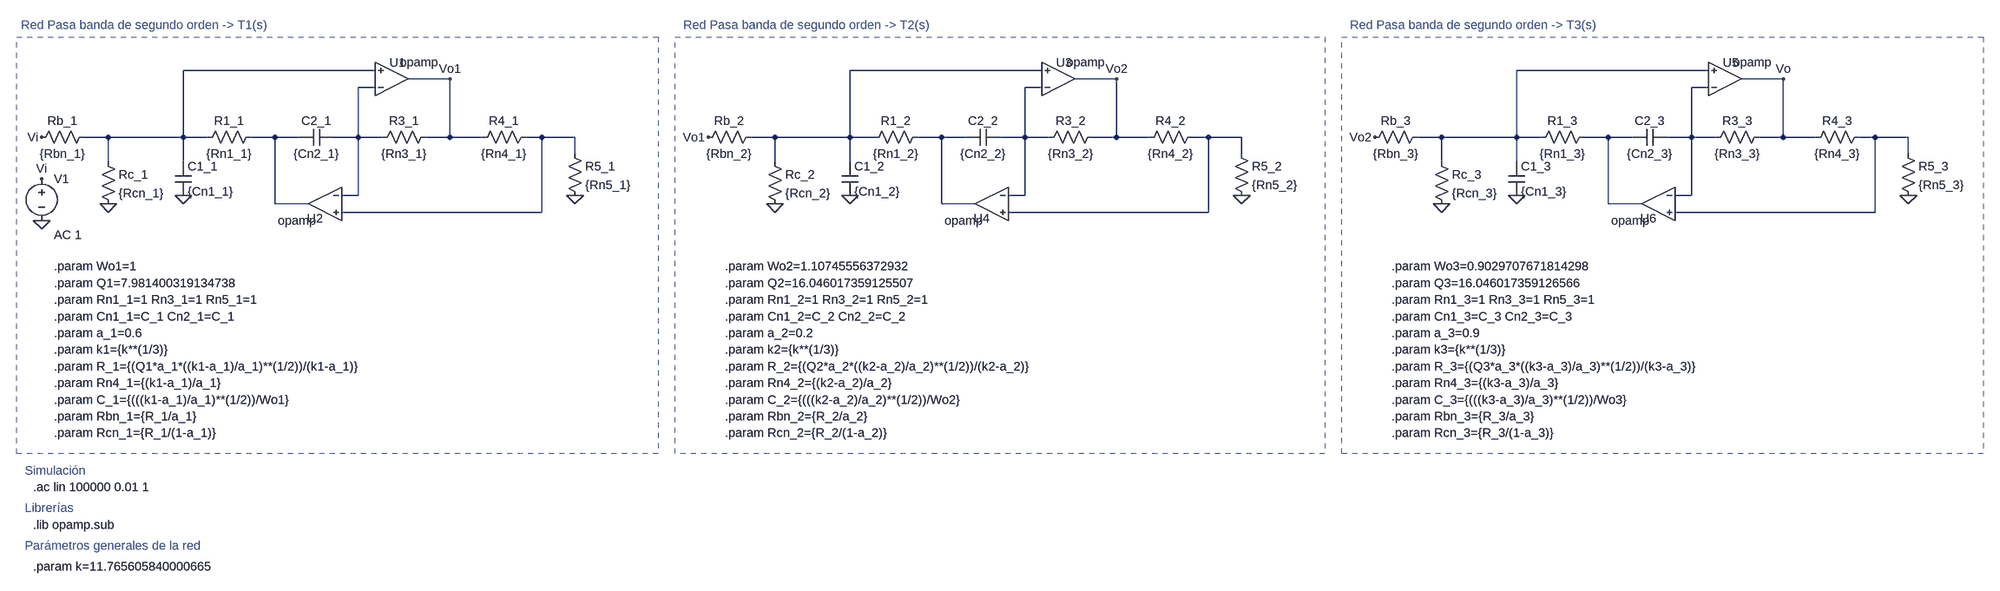
[diagram p0: schematic simulación circuital red activa 2.asc]
simulación circuital red activa 2.asc, the LTspice schematic file:
Version 4
SHEET 1 3268 1080
WIRE 176 16 -192 16
WIRE 1456 16 1088 16
WIRE 2736 16 2368 16
WIRE 320 32 240 32
WIRE 1600 32 1520 32
WIRE 2880 32 2800 32
WIRE 176 48 144 48
WIRE 1456 48 1424 48
WIRE 2736 48 2704 48
WIRE -336 144 -384 144
WIRE -192 144 -192 16
WIRE -192 144 -336 144
WIRE -144 144 -192 144
WIRE -16 144 -64 144
WIRE 32 144 -16 144
WIRE 144 144 144 48
WIRE 144 144 96 144
WIRE 192 144 144 144
WIRE 320 144 320 32
WIRE 320 144 272 144
WIRE 384 144 320 144
WIRE 496 144 464 144
WIRE 560 144 496 144
WIRE 944 144 896 144
WIRE 1088 144 1088 16
WIRE 1088 144 944 144
WIRE 1136 144 1088 144
WIRE 1264 144 1216 144
WIRE 1312 144 1264 144
WIRE 1424 144 1424 48
WIRE 1424 144 1376 144
WIRE 1472 144 1424 144
WIRE 1600 144 1600 32
WIRE 1600 144 1552 144
WIRE 1664 144 1600 144
WIRE 1776 144 1744 144
WIRE 1840 144 1776 144
WIRE 2224 144 2176 144
WIRE 2368 144 2368 16
WIRE 2368 144 2224 144
WIRE 2416 144 2368 144
WIRE 2544 144 2496 144
WIRE 2592 144 2544 144
WIRE 2704 144 2704 48
WIRE 2704 144 2656 144
WIRE 2752 144 2704 144
WIRE 2880 144 2880 32
WIRE 2880 144 2832 144
WIRE 2944 144 2880 144
WIRE 3056 144 3024 144
WIRE 3120 144 3056 144
WIRE 560 176 560 144
WIRE 1840 176 1840 144
WIRE 3120 176 3120 144
WIRE -336 192 -336 144
WIRE -192 192 -192 144
WIRE 944 192 944 144
WIRE 1088 192 1088 144
WIRE 2224 192 2224 144
WIRE 2368 192 2368 144
WIRE 144 256 144 144
WIRE 144 256 112 256
WIRE 1424 256 1424 144
WIRE 1424 256 1392 256
WIRE 2704 256 2704 144
WIRE 2704 256 2672 256
WIRE -16 272 -16 144
WIRE 48 272 -16 272
WIRE 1264 272 1264 144
WIRE 1328 272 1264 272
WIRE 2544 272 2544 144
WIRE 2608 272 2544 272
WIRE 496 288 496 144
WIRE 496 288 112 288
WIRE 1776 288 1776 144
WIRE 1776 288 1392 288
WIRE 3056 288 3056 144
WIRE 3056 288 2672 288
FLAG 560 256 0
FLAG -192 256 0
FLAG -336 272 0
FLAG -464 144 Vi
FLAG 320 32 Vo1
FLAG -464 304 0
FLAG -464 224 Vi
FLAG 1840 256 0
FLAG 1088 256 0
FLAG 944 272 0
FLAG 1600 32 Vo2
FLAG 3120 256 0
FLAG 2368 256 0
FLAG 2224 272 0
FLAG 2880 32 Vo
FLAG 816 144 Vo1
FLAG 2096 144 Vo2
SYMBOL OpAmps\\opamp 208 96 M180
WINDOW 0 -4 95 Left 2
SYMATTR InstName U1
SYMBOL OpAmps\\opamp 80 208 M0
WINDOW 0 4 92 Left 2
SYMATTR InstName U2
SYMBOL res -48 128 R90
WINDOW 0 0 56 VBottom 2
WINDOW 3 32 56 VTop 2
SYMATTR InstName R1_1
SYMATTR Value {Rn1_1}
SYMBOL cap -208 192 R0
SYMATTR InstName C1_1
SYMATTR Value {Cn1_1}
SYMBOL cap 96 128 R90
WINDOW 0 0 32 VBottom 2
WINDOW 3 32 32 VTop 2
SYMATTR InstName C2_1
SYMATTR Value {Cn2_1}
SYMBOL res 288 128 R90
WINDOW 0 0 56 VBottom 2
WINDOW 3 32 56 VTop 2
SYMATTR InstName R3_1
SYMATTR Value {Rn3_1}
SYMBOL res 480 128 R90
WINDOW 0 0 56 VBottom 2
WINDOW 3 32 56 VTop 2
SYMATTR InstName R4_1
SYMATTR Value {Rn4_1}
SYMBOL res 544 160 R0
SYMATTR InstName R5_1
SYMATTR Value {Rn5_1}
SYMBOL res -352 176 R0
SYMATTR InstName Rc_1
SYMATTR Value {Rcn_1}
SYMBOL res -368 128 R90
WINDOW 0 0 56 VBottom 2
WINDOW 3 32 56 VTop 2
SYMATTR InstName Rb_1
SYMATTR Value {Rbn_1}
SYMBOL voltage -464 208 R0
WINDOW 123 24 124 Left 2
WINDOW 39 0 0 Left 0
SYMATTR Value2 AC 1
SYMATTR InstName V1
SYMATTR Value ""
SYMBOL OpAmps\\opamp 1488 96 M180
WINDOW 0 -4 95 Left 2
SYMATTR InstName U3
SYMBOL OpAmps\\opamp 1360 208 M0
WINDOW 0 4 92 Left 2
SYMATTR InstName U4
SYMBOL res 1232 128 R90
WINDOW 0 0 56 VBottom 2
WINDOW 3 32 56 VTop 2
SYMATTR InstName R1_2
SYMATTR Value {Rn1_2}
SYMBOL cap 1072 192 R0
SYMATTR InstName C1_2
SYMATTR Value {Cn1_2}
SYMBOL cap 1376 128 R90
WINDOW 0 0 32 VBottom 2
WINDOW 3 32 32 VTop 2
SYMATTR InstName C2_2
SYMATTR Value {Cn2_2}
SYMBOL res 1568 128 R90
WINDOW 0 0 56 VBottom 2
WINDOW 3 32 56 VTop 2
SYMATTR InstName R3_2
SYMATTR Value {Rn3_2}
SYMBOL res 1760 128 R90
WINDOW 0 0 56 VBottom 2
WINDOW 3 32 56 VTop 2
SYMATTR InstName R4_2
SYMATTR Value {Rn4_2}
SYMBOL res 1824 160 R0
SYMATTR InstName R5_2
SYMATTR Value {Rn5_2}
SYMBOL res 928 176 R0
SYMATTR InstName Rc_2
SYMATTR Value {Rcn_2}
SYMBOL res 912 128 R90
WINDOW 0 0 56 VBottom 2
WINDOW 3 32 56 VTop 2
SYMATTR InstName Rb_2
SYMATTR Value {Rbn_2}
SYMBOL OpAmps\\opamp 2768 96 M180
WINDOW 0 -4 95 Left 2
SYMATTR InstName U5
SYMBOL OpAmps\\opamp 2640 208 M0
WINDOW 0 4 92 Left 2
SYMATTR InstName U6
SYMBOL res 2512 128 R90
WINDOW 0 0 56 VBottom 2
WINDOW 3 32 56 VTop 2
SYMATTR InstName R1_3
SYMATTR Value {Rn1_3}
SYMBOL cap 2352 192 R0
SYMATTR InstName C1_3
SYMATTR Value {Cn1_3}
SYMBOL cap 2656 128 R90
WINDOW 0 0 32 VBottom 2
WINDOW 3 32 32 VTop 2
SYMATTR InstName C2_3
SYMATTR Value {Cn2_3}
SYMBOL res 2848 128 R90
WINDOW 0 0 56 VBottom 2
WINDOW 3 32 56 VTop 2
SYMATTR InstName R3_3
SYMATTR Value {Rn3_3}
SYMBOL res 3040 128 R90
WINDOW 0 0 56 VBottom 2
WINDOW 3 32 56 VTop 2
SYMATTR InstName R4_3
SYMATTR Value {Rn4_3}
SYMBOL res 3104 160 R0
SYMATTR InstName R5_3
SYMATTR Value {Rn5_3}
SYMBOL res 2208 176 R0
SYMATTR InstName Rc_3
SYMATTR Value {Rcn_3}
SYMBOL res 2192 128 R90
WINDOW 0 0 56 VBottom 2
WINDOW 3 32 56 VTop 2
SYMATTR InstName Rb_3
SYMATTR Value {Rbn_3}
TEXT -480 888 Left 2 !.lib opamp.sub
TEXT -480 816 Left 2 !.ac lin 100000 0.01 1
TEXT -440 392 Left 2 !.param Wo1=1
TEXT -440 424 Left 2 !.param Q1=7.981400319134738
TEXT -440 456 Left 2 !.param Rn1_1=1 Rn3_1=1 Rn5_1=1
TEXT -440 488 Left 2 !.param Cn1_1=C_1 Cn2_1=C_1
TEXT -440 616 Left 2 !.param Rn4_1={(k1-a_1)/a_1}
TEXT -440 648 Left 2 !.param C_1={(((k1-a_1)/a_1)**(1/2))/Wo1}
TEXT -440 520 Left 2 !.param a_1=0.6
TEXT -440 680 Left 2 !.param Rbn_1={R_1/a_1}
TEXT -440 712 Left 2 !.param Rcn_1={R_1/(1-a_1)}
TEXT -440 552 Left 2 !.param k1={k**(1/3)}
TEXT -480 968 Left 2 !.param k=11.765605840000665
TEXT 848 456 Left 2 !.param Rn1_2=1 Rn3_2=1 Rn5_2=1
TEXT 848 488 Left 2 !.param Cn1_2=C_2 Cn2_2=C_2
TEXT 848 680 Left 2 !.param Rbn_2={R_2/a_2}
TEXT 848 712 Left 2 !.param Rcn_2={R_2/(1-a_2)}
TEXT 848 552 Left 2 !.param k2={k**(1/3)}
TEXT 2128 456 Left 2 !.param Rn1_3=1 Rn3_3=1 Rn5_3=1
TEXT 2128 488 Left 2 !.param Cn1_3=C_3 Cn2_3=C_3
TEXT 2128 680 Left 2 !.param Rbn_3={R_3/a_3}
TEXT 2128 712 Left 2 !.param Rcn_3={R_3/(1-a_3)}
TEXT 2128 552 Left 2 !.param k3={k**(1/3)}
TEXT -440 584 Left 2 !.param R_1={(Q1*a_1*((k1-a_1)/a_1)**(1/2))/(k1-a_1)}
TEXT 848 520 Left 2 !.param a_2=0.2
TEXT 848 584 Left 2 !.param R_2={(Q2*a_2*((k2-a_2)/a_2)**(1/2))/(k2-a_2)}
TEXT 848 616 Left 2 !.param Rn4_2={(k2-a_2)/a_2}
TEXT 848 648 Left 2 !.param C_2={(((k2-a_2)/a_2)**(1/2))/Wo2}
TEXT 2128 520 Left 2 !.param a_3=0.9
TEXT 2128 584 Left 2 !.param R_3={(Q3*a_3*((k3-a_3)/a_3)**(1/2))/(k3-a_3)}
TEXT 2128 616 Left 2 !.param Rn4_3={(k3-a_3)/a_3}
TEXT 2128 648 Left 2 !.param C_3={(((k3-a_3)/a_3)**(1/2))/Wo3}
TEXT -504 -72 Left 2 ;Red Pasa banda de segundo orden -> T1(s)
TEXT 768 -72 Left 2 ;Red Pasa banda de segundo orden -> T2(s)
TEXT 2048 -72 Left 2 ;Red Pasa banda de segundo orden -> T3(s)
TEXT -496 784 Left 2 ;Simulación
TEXT -496 856 Left 2 ;Librerías
TEXT -496 928 Left 2 ;Parámetros generales de la red
TEXT 848 392 Left 2 !.param Wo2=1.10745556372932
TEXT 848 424 Left 2 !.param Q2=16.046017359125507
TEXT 2128 392 Left 2 !.param Wo3=0.9029707671814298
TEXT 2128 424 Left 2 !.param Q3=16.046017359126566
RECTANGLE Normal 720 752 -512 -48 2
RECTANGLE Normal 2000 752 752 -48 2
RECTANGLE Normal 3264 752 2032 -48 2

The netlist it stands for:
* simulación circuital red activa 2.asc
XU1 N004 N001 Vo1 opamp Aol=100K GBW=10Meg  ; pins invin noninvin out
XU2 N004 N008 N007 opamp Aol=100K GBW=10Meg  ; pins invin noninvin out
R1_1 N007 N001 {Rn1_1}
C1_1 N001 0 {Cn1_1}
C2_1 N004 N007 {Cn2_1}
R3_1 Vo1 N004 {Rn3_1}
R4_1 N008 Vo1 {Rn4_1}
R5_1 N008 0 {Rn5_1}
Rc_1 N001 0 {Rcn_1}
Rb_1 N001 Vi {Rbn_1}
V1 Vi 0 AC 1
XU3 N005 N002 Vo2 opamp Aol=100K GBW=10Meg  ; pins invin noninvin out
XU4 N005 N010 N009 opamp Aol=100K GBW=10Meg  ; pins invin noninvin out
R1_2 N009 N002 {Rn1_2}
C1_2 N002 0 {Cn1_2}
C2_2 N005 N009 {Cn2_2}
R3_2 Vo2 N005 {Rn3_2}
R4_2 N010 Vo2 {Rn4_2}
R5_2 N010 0 {Rn5_2}
Rc_2 N002 0 {Rcn_2}
Rb_2 N002 Vo1 {Rbn_2}
XU5 N006 N003 Vo opamp Aol=100K GBW=10Meg  ; pins invin noninvin out
XU6 N006 N012 N011 opamp Aol=100K GBW=10Meg  ; pins invin noninvin out
R1_3 N011 N003 {Rn1_3}
C1_3 N003 0 {Cn1_3}
C2_3 N006 N011 {Cn2_3}
R3_3 Vo N006 {Rn3_3}
R4_3 N012 Vo {Rn4_3}
R5_3 N012 0 {Rn5_3}
Rc_3 N003 0 {Rcn_3}
Rb_3 N003 Vo2 {Rbn_3}
.lib opamp.sub
.ac lin 100000 0.01 1
.param Wo1=1
.param Q1=7.981400319134738
.param Rn1_1=1 Rn3_1=1 Rn5_1=1
.param Cn1_1=C_1 Cn2_1=C_1
.param Rn4_1={(k1-a_1)/a_1}
.param C_1={(((k1-a_1)/a_1)**(1/2))/Wo1}
.param a_1=0.6
.param Rbn_1={R_1/a_1}
.param Rcn_1={R_1/(1-a_1)}
.param k1={k**(1/3)}
.param k=11.765605840000665
.param Rn1_2=1 Rn3_2=1 Rn5_2=1
.param Cn1_2=C_2 Cn2_2=C_2
.param Rbn_2={R_2/a_2}
.param Rcn_2={R_2/(1-a_2)}
.param k2={k**(1/3)}
.param Rn1_3=1 Rn3_3=1 Rn5_3=1
.param Cn1_3=C_3 Cn2_3=C_3
.param Rbn_3={R_3/a_3}
.param Rcn_3={R_3/(1-a_3)}
.param k3={k**(1/3)}
.param R_1={(Q1*a_1*((k1-a_1)/a_1)**(1/2))/(k1-a_1)}
.param a_2=0.2
.param R_2={(Q2*a_2*((k2-a_2)/a_2)**(1/2))/(k2-a_2)}
.param Rn4_2={(k2-a_2)/a_2}
.param C_2={(((k2-a_2)/a_2)**(1/2))/Wo2}
.param a_3=0.9
.param R_3={(Q3*a_3*((k3-a_3)/a_3)**(1/2))/(k3-a_3)}
.param Rn4_3={(k3-a_3)/a_3}
.param C_3={(((k3-a_3)/a_3)**(1/2))/Wo3}
* Red Pasa banda de segundo orden -> T1(s)
* Red Pasa banda de segundo orden -> T2(s)
* Red Pasa banda de segundo orden -> T3(s)
* Simulación
* Librerías
* Parámetros generales de la red
.param Wo2=1.10745556372932
.param Q2=16.046017359125507
.param Wo3=0.9029707671814298
.param Q3=16.046017359126566
.backanno
.end